# Altium schematic sheet driver-power-stage.SchDoc
size A4; SheetNumber: 10; SheetTotal: 14
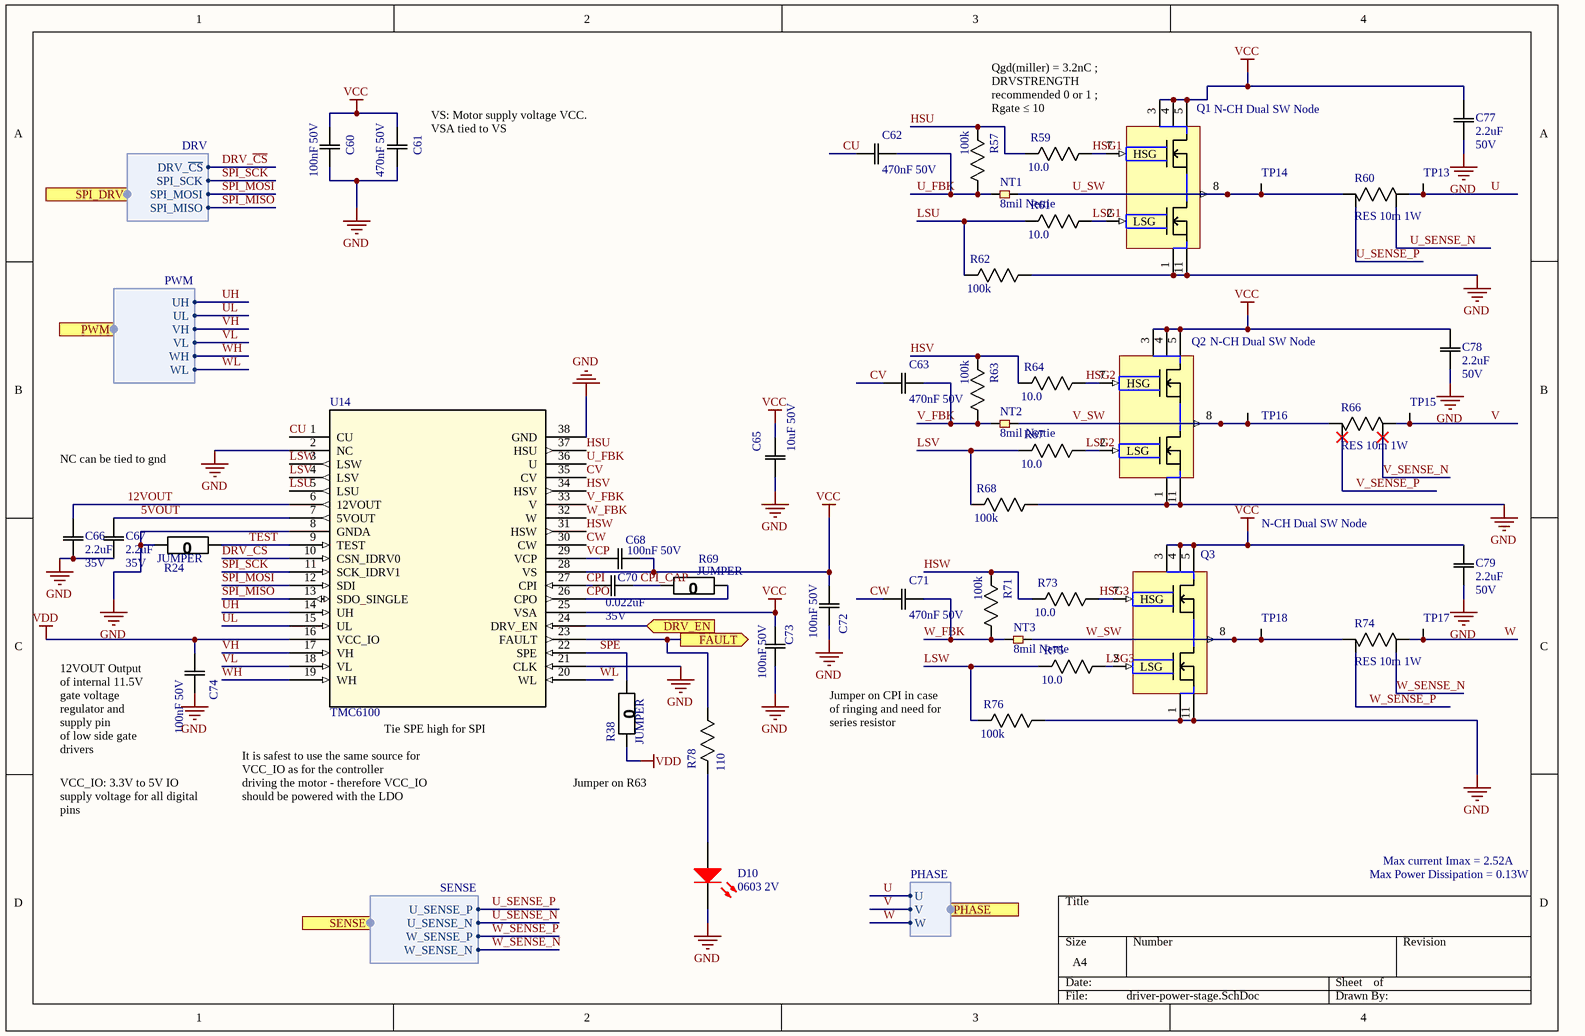
[diagram p0: driver-power-stage.SchDoc]

## Parts
C60  100nF 50V  [0603]
C61  470nF 50V  [0603]
C62  470nF 50V  [0603]
C63  470nF 50V  [0603]
C65  10uF 50V  [0805]
C66  value 2.2uF  Rating: 35V  [0603]  (hidden comment: 2.2uF 35V)
C67  value 2.2uF  Rating: 35V  [0603]  (hidden comment: 2.2uF 35V)
C68  100nF 50V  [0603]
C70  value 0.022uF  Rating: 35V  [0603]  (hidden comment: 0.022uF 35V)
C71  470nF 50V  [0603]
C72  100nF 50V  [0603]
C73  100nF 50V  [0603]
C74  100nF 50V  [0603]
C77  Rating: 50V  [0603]  (hidden comment: 2.2uF)
C78  Rating: 50V  [0603]  (hidden comment: 2.2uF)
C79  Rating: 50V  [0603]  (hidden comment: 2.2uF)
D10  0603 2V  [0603 - LED2]
NT1  8mil Nettie  [NT_8mil]  (net tie, no BOM)
NT2  8mil Nettie  [NT_8mil]  (net tie, no BOM)
NT3  8mil Nettie  [NT_8mil]  (net tie, no BOM)
Q1  N-CH Dual SW Node  [12-PowerWQFN]
Q2  N-CH Dual SW Node  [12-PowerWQFN]
Q3  N-CH Dual SW Node  [12-PowerWQFN]
R24  JUMPER  [0603]
R38  JUMPER  [0603]
R57  100k  [0603]
R59  10.0  [0603]
R60  RES 10m 1W  [1206 - Current Sense]
R61  10.0  [0603]
R62  100k  [0603]
R63  100k  [0603]
R64  10.0  [0603]
R66  RES 10m 1W  [1206 - Current Sense]
R67  10.0  [0603]
R68  100k  [0603]
R69  JUMPER  [0603]
R71  100k  [0603]
R73  10.0  [0603]
R74  RES 10m 1W  [1206 - Current Sense]
R75  10.0  [0603]
R76  100k  [0603]
R78  110  [0603]
TP13  U_SL  [TP]  (value not drawn)  (no BOM)
TP14  U_SH  [TP]  (value not drawn)  (no BOM)
TP15  V_SL  [TP]  (value not drawn)  (no BOM)
TP16  V_SH  [TP]  (value not drawn)  (no BOM)
TP17  W_SL  [TP]  (value not drawn)  (no BOM)
TP18  W_SH  [TP]  (value not drawn)  (no BOM)
U14  TMC6100  [QFN50P700X700X85_HS-38N]

## Ports
DRV_EN (in), FAULT (out), PHASE (harness PHASE), PWM (harness PWM), SENSE (harness SENSE), SPI_DRV (harness DRV)

## Harnesses
PWM: VL, WH, WL, VH, UL, UH
SENSE: U_SENSE_P, U_SENSE_N, W_SENSE_P, W_SENSE_N
PHASE: U, V, W
DRV: SPI_SCK, SPI_MISO, SPI_MOSI, DRV_~{CS}

## Nets
GND: C60.2(C2) C61.2(C2) C65.1(C1) C66.1(C1) C67.1(C1) C72.2(C2) C73.2(C2) C74.2(C2) C77.1(C1) C78.1(C1) C79.1(C1) D10.2(K) Q1.1(GND) Q1.11(GND) Q2.1(GND) Q2.11(GND) Q3.1(GND) Q3.11(GND) R24.2(R2) R62.1(R1) R68.1(R1) R76.1(R1) U14.2(NC) U14.8(GNDA) U14.21(CLK) U14.38(GND)
VCC: C60.1(C1) C61.1(C1) C65.2(C2) C68.2(C2) C72.1(C1) C73.1(C1) C77.2(C2) C78.2(C2) C79.2(C2) Q1.3(V+) Q1.4(V+) Q1.5(V+) Q2.3(V+) Q2.4(V+) Q2.5(V+) Q3.3(V+) Q3.4(V+) Q3.5(V+) U14.25(VSA) U14.28(VS)
VDD: C74.1(C1) R38.2(R2) U14.16(VCC_IO)
5VOUT: C67.2(C2) U14.7(5VOUT)
12VOUT: C66.2(C2) U14.6(12VOUT)
CPI: C70.1(C1) U14.27(CPI)
CPI_CAP: C70.2(C2) R69.2(R2)
CPO: R69.1(R1) U14.26(CPO)
CU: C62.1(C1) U14.1(CU)
CV: C63.1(C1) U14.35(CV)
CW: C71.1(C1) U14.30(CW)
DRV_~{CS}: U14.10(CSN_IDRV0) ; port SPI_DRV.DRV_~{CS}
DRV_EN: U14.24(DRV_EN) ; port DRV_EN
FAULT: R78.1(R1) U14.23(FAULT) ; port FAULT
HSG1: Q1.7(HSG) R59.1(R1)
HSG2: Q2.7(HSG) R64.1(R1)
HSG3: Q3.7(HSG) R73.1(R1)
HSU: R57.2(R2) R59.2(R2) U14.37(HSU)
HSV: R63.2(R2) R64.2(R2) U14.34(HSV)
HSW: R71.2(R2) R73.2(R2) U14.31(HSW)
LSG1: Q1.2(LSG) R61.1(R1)
LSG2: Q2.2(LSG) R67.1(R1)
LSG3: Q3.2(LSG) R75.1(R1)
LSU: R61.2(R2) R62.2(R2) U14.5(LSU)
LSV: R67.2(R2) R68.2(R2) U14.4(LSV)
LSW: R75.2(R2) R76.2(R2) U14.3(LSW)
SPE: R38.1(R1) U14.22(SPE)
SPI_MISO: U14.13(SDO_SINGLE) ; port SPI_DRV.SPI_MISO
SPI_MOSI: U14.12(SDI) ; port SPI_DRV.SPI_MOSI
SPI_SCK: U14.11(SCK_IDRV1) ; port SPI_DRV.SPI_SCK
TEST: R24.1(R1) U14.9(TEST)
U: R60.1 TP13.1 ; port PHASE.U
U_FBK: C62.2(C2) NT1.1 R57.1(R1) U14.36(U)
U_SENSE_N: R60.S1 ; port SENSE.U_SENSE_N
U_SENSE_P: R60.S2 ; port SENSE.U_SENSE_P
U_SW: NT1.2 Q1.8(SW) R60.2 TP14.1
UH: U14.14(UH) ; port PWM.UH
UL: U14.15(UL) ; port PWM.UL
V: R66.1 TP15.1 ; port PHASE.V
V_FBK: C63.2(C2) NT2.1 R63.1(R1) U14.33(V)
V_SENSE_N: R66.S1
V_SENSE_P: R66.S2
V_SW: NT2.2 Q2.8(SW) R66.2 TP16.1
VCP: C68.1(C1) U14.29(VCP)
VH: U14.17(VH) ; port PWM.VH
VL: U14.18(VL) ; port PWM.VL
W: R74.1 TP17.1 ; port PHASE.W
W_FBK: C71.2(C2) NT3.1 R71.1(R1) U14.32(W)
W_SENSE_N: R74.S1 ; port SENSE.W_SENSE_N
W_SENSE_P: R74.S2 ; port SENSE.W_SENSE_P
W_SW: NT3.2 Q3.8(SW) R74.2 TP18.1
WH: U14.19(WH) ; port PWM.WH
WL: U14.20(WL) ; port PWM.WL
NetD10_1: D10.1(A) R78.2(R2)

## Notes on the sheet
- Text
- (near Q1) Qgd(miller) = 3.2nC ; DRVSTRENGTH recommended 0 or 1 ; Rgate ≤ 10
- (near C61) VS: Motor supply voltage VCC. VSA tied to VS
- NC can be tied to gnd
- (near C74) 12VOUT Output of internal 11.5V gate voltage regulator and supply pin
  of low side gate drivers
- Tie SPE high for SPI
- Jumper on CPI in case of ringing and need for series resistor
- VCC_IO: 3.3V to 5V IO supply voltage for all digital pins
- It is safest to use the same source for VCC_IO as for the controller
  driving the motor - therefore VCC_IO should be powered with the LDO
- Jumper on R63
- Max Power Dissipation = 0.13W
- Max current Imax = 2.52A

## Library data of the parts
C60 C68 C72-C74 = CAP 100nF 50V: Default Symbol for Capacitors; Manufacturer Part Number 1: CC0603KPX7R9BB104; Tolerance: 10%; Temperature Coefficient: X7R; VALUE: 100nF; Rating: 50V; Part Number: CAP 100nF 50V; Supplier 1: Digi-Key; Supplier Part Number 1: 311-3567-1-ND; Manufacturer Part Number 2: 0805J0500104KJT; Supplier 2: Digi-Key; Supplier Part Number 2: 1608-1458-1-ND
C61-C63 C71 = CAP 470nF 50V: Default Symbol for Capacitors; Manufacturer Part Number 1: C1608X7R1H474K080AC; Tolerance: 10%; Temperature Coefficient: X7R; VALUE: 470nF; Rating: 50V; Part Number: CAP 470nF 50V; Supplier 1: Digi-Key; Supplier Part Number 1: 445-5952-1-ND; Manufacturer Part Number 2: CL21B474KBFNNNG; Supplier 2: Digi-Key; Supplier Part Number 2: 1276-6482-1-ND
C65 = CAP 10uF 50V: Default Symbol for Capacitors; Manufacturer Part Number 1: GRM21BR61H106KE43L; Tolerance: 10%; Temperature Coefficient: X5R; VALUE: 10uF; Rating: 50V; Part Number: CAP 10uF 50V; Supplier 1: Digi-Key; Supplier Part Number 1: 490-18663-1-ND; Manufacturer Part Number 2: CL32B106KBJNNWE; Supplier 2: Digi-Key; Supplier Part Number 2: 1276-3388-1-ND
C66 C67 = CAP 2.2uF 35V: Default Symbol for Capacitors; Manufacturer Part Number 1: C1608X5R1V225K080AC; Tolerance: 10%; Temperature Coefficient: X5R; Part Number: CAP 2.2uF 35V; Supplier 1: Digi-Key; Supplier Part Number 1: 445-8025-1-ND; Manufacturer Part Number 2: CGA4J1X7R1V225K125AE; Supplier 2: Digi-Key; Supplier Part Number 2: 445-8787-1-ND
C70 = CAP 0.022uF 35V: Default Symbol for Capacitors; Manufacturer Part Number 1: GMK107BJ223KAHT; Tolerance: 10%; Temperature Coefficient: X7R; Part Number: CAP 0.022uF 35V; Supplier 1: Digi-Key; Supplier Part Number 1: 587-3359-1-ND; Manufacturer Part Number 2: GMK212SD223KG-T; Supplier 2: Digi-Key; Supplier Part Number 2: 587-1122-1-ND
C77-C79 = CAP 2.2uF 50V: CAP CER 2.2UF 50V X5R 0603/0805; Manufacturer Part Number 1: GRM188R61H225KE11D; Tolerance: 10%; Package: 0603/0805; Temperature Coefficient: X5R; Operating Temperature: -55°C ~ 125°C; Value: 2.2uF; Part Number: CAP 2.2uF 50V; Supplier 1: Mouser; Supplier Part Number 1: 81-GRM188R61H225KE1D
D10 = LED RED SMD 0603: 0603 red led alingap 631nm-639nm water clear 18-180mcd 130d; Manufacturer Part Number 1: LTST-C190KRKT; Current Rating: 20mA; Supplier 1: Digi-Key; Supplier Part Number 1: 160-1436-1-ND; Part Number: LED RED SMD 0603; Supplier URL 1: https://www.digikey.ca/en/products/detail/lite-on-inc/LTST-C190KRKT/386817?s=N4IgTCBcDaIIwDYAMBaOAWAzAtKByAIiALoC%2BQA; Pin Count: 2; Voltage Rating - DC: 2V
NT1-NT3 = NT_8: 8mil wide nettie; Value: 0; Part Number: NT_8
Q1-Q3 = MOSFET N-CH DUAL NTTFD4D0N04HLTWG: MOSFET N+N COMMON PHASE SW 40V 60A; Supplier 1: Digi-Key; Supplier Part Number 1: 488-NTTFD4D0N04HLTWGCT-ND; Part Number: MOSFET N-CH DUAL NTTFD4D0N04HLTWG; Supplier URL 1: https://www.digikey.ca/en/products/detail/onsemi/NTTFD4D0N04HLTWG/12181286?s=N4IgTCBcDaIHIBUEDEAiAWVAGOX0AkAZBAdQHEBhBEAXQF8g; Manufacturer Part Number 1: NTTFD4D0N04HLTWG
R24 R38 R69 = RES 0 JUMPER: RES SMD 0 OHM JUMPER GENERIC 0805; Manufacturer Part Number 1: RK73Z1JTTD; VALUE: 0; Package: 0805; Part Number: RES 0 JUMPER; Supplier 1: Digi-Key; Supplier Part Number 1: 2019-RK73Z1JTTDCT-ND; Supplier URL 1: https://www.digikey.ca/en/products/detail/koa-speer-electronics-inc/RK73Z1JTTD/9845478; Tolerance: N/A
R57 R62 R63 R68 R71 R76 = RES 100k 1/8W 5%: RES SMD 100K OHM 5% 1/8W 0805; Power (Watts): 0.125W; Package: 0805; VALUE: 100k; Tolerance: 5%; Part Number: RES 100k 1/8W 5%
R59 R61 R64 R67 R73 R75 = RES 10.0 1/8W - 1%: Default Resistor Symbol; Manufacturer Part Number 1: RNCP0603FTD10R0; VALUE: 10; Power (Watts): 0.125W; Tolerance: 1%; Package: 0805; Part Number: RES 10.0 1/8W - 1%; Supplier 1: Digi-Key; Supplier Part Number 1: RNCP0603FTD10R0CT-ND; Manufacturer Part Number 2: RNCP0603FTD10R0; Supplier 2: Digi-Key; Supplier Part Number 2: RNCP0603FTD10R0CT-ND; Tolerance 2: 1%; Supplier URL 1: https://www.digikey.ca/en/products/detail/stackpole-electronics-inc/RNCP0603FTD10R0/2240074?s=N4IgTCBcDaIEoDkDCAFADANjQZgGIBUARARjTjSXxAF0BfIA; Supplier URL 2: https://www.digikey.ca/en/products/detail/stackpole-electronics-inc/RNCP0603FTD10R0/2240074?s=N4IgTCBcDaIEoDkDCAFADANjQZgGIBUARARjTjSXxAF0BfIA
R60 R66 R74 = RES 10m 1W: RES SMD 0.01 OHM 1% 1W 1206; Manufacturer Part Number 1: CSRL1-0R01F8; Part Number: RES 10m 1W; Value: 10m; Tolerance: 1%; Supplier 1: Digi-Key; Supplier Part Number 1: 696-1845-1-ND; Supplier URL 1: https://www.digikey.ca/en/products/detail/riedon/CSRL1-0R01F8/9666060?s=N4IgTCBcDaIGwE44FoCMAOALAVjcgcgCIgC6AvkA
R78 = RES 110.0 1/8W - 1%: Default Resistor Symbol; Manufacturer Part Number 1: RMCF0603FT110R; Power (Watts): 0.125W; Tolerance: 1%; Package: 0805; Value: 110; Part Number: RES 110.0 1/8W - 1%; Supplier 1: Digi-Key; Supplier Part Number 1: RMCF0603FT110RCT-ND; Supplier URL 1: https://www.digikey.ca/en/products/detail/stackpole-electronics-inc/RMCF0603FT110R/1761268
TP13-TP18 = Test Point (Via): Part Number: Test Point (Via)
U14 = TMC6100: GATE DRIVER IC 8-60V QFN37; Manufacturer Part Number 1: TMC6100-LA; Supplier 1: Newark; Supplier Part Number 1: 54AH1603; Part Number: TMC6100; Supplier URL 1: https://canada.newark.com/trinamic/tmc6100-la/motor-driver-40-to-125deg-c-rohs/dp/54AH1603?ost=54ah1603